# EAGLE design RadioGateway (EAGLE 7.6.0)
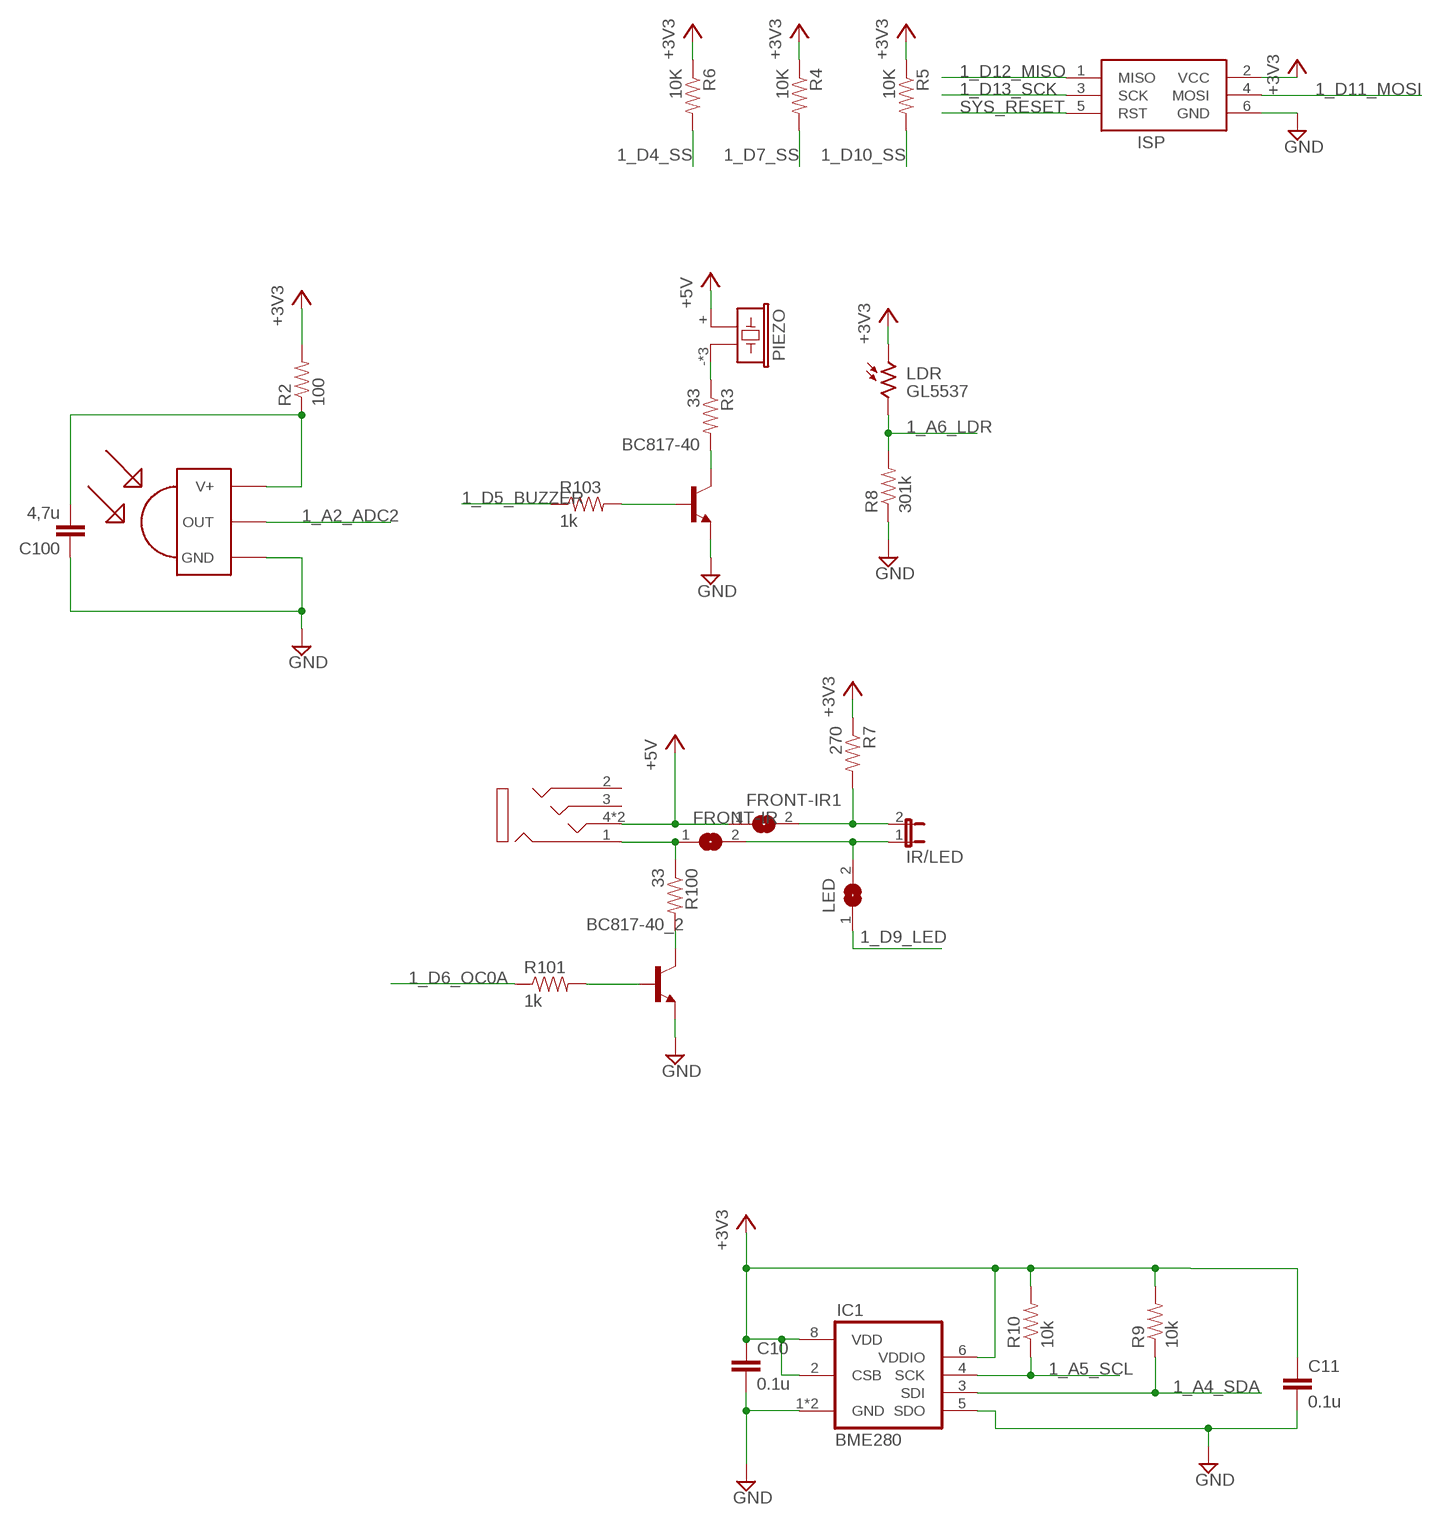
[diagram p0: schematic, sheet 1, part 1 of 2]
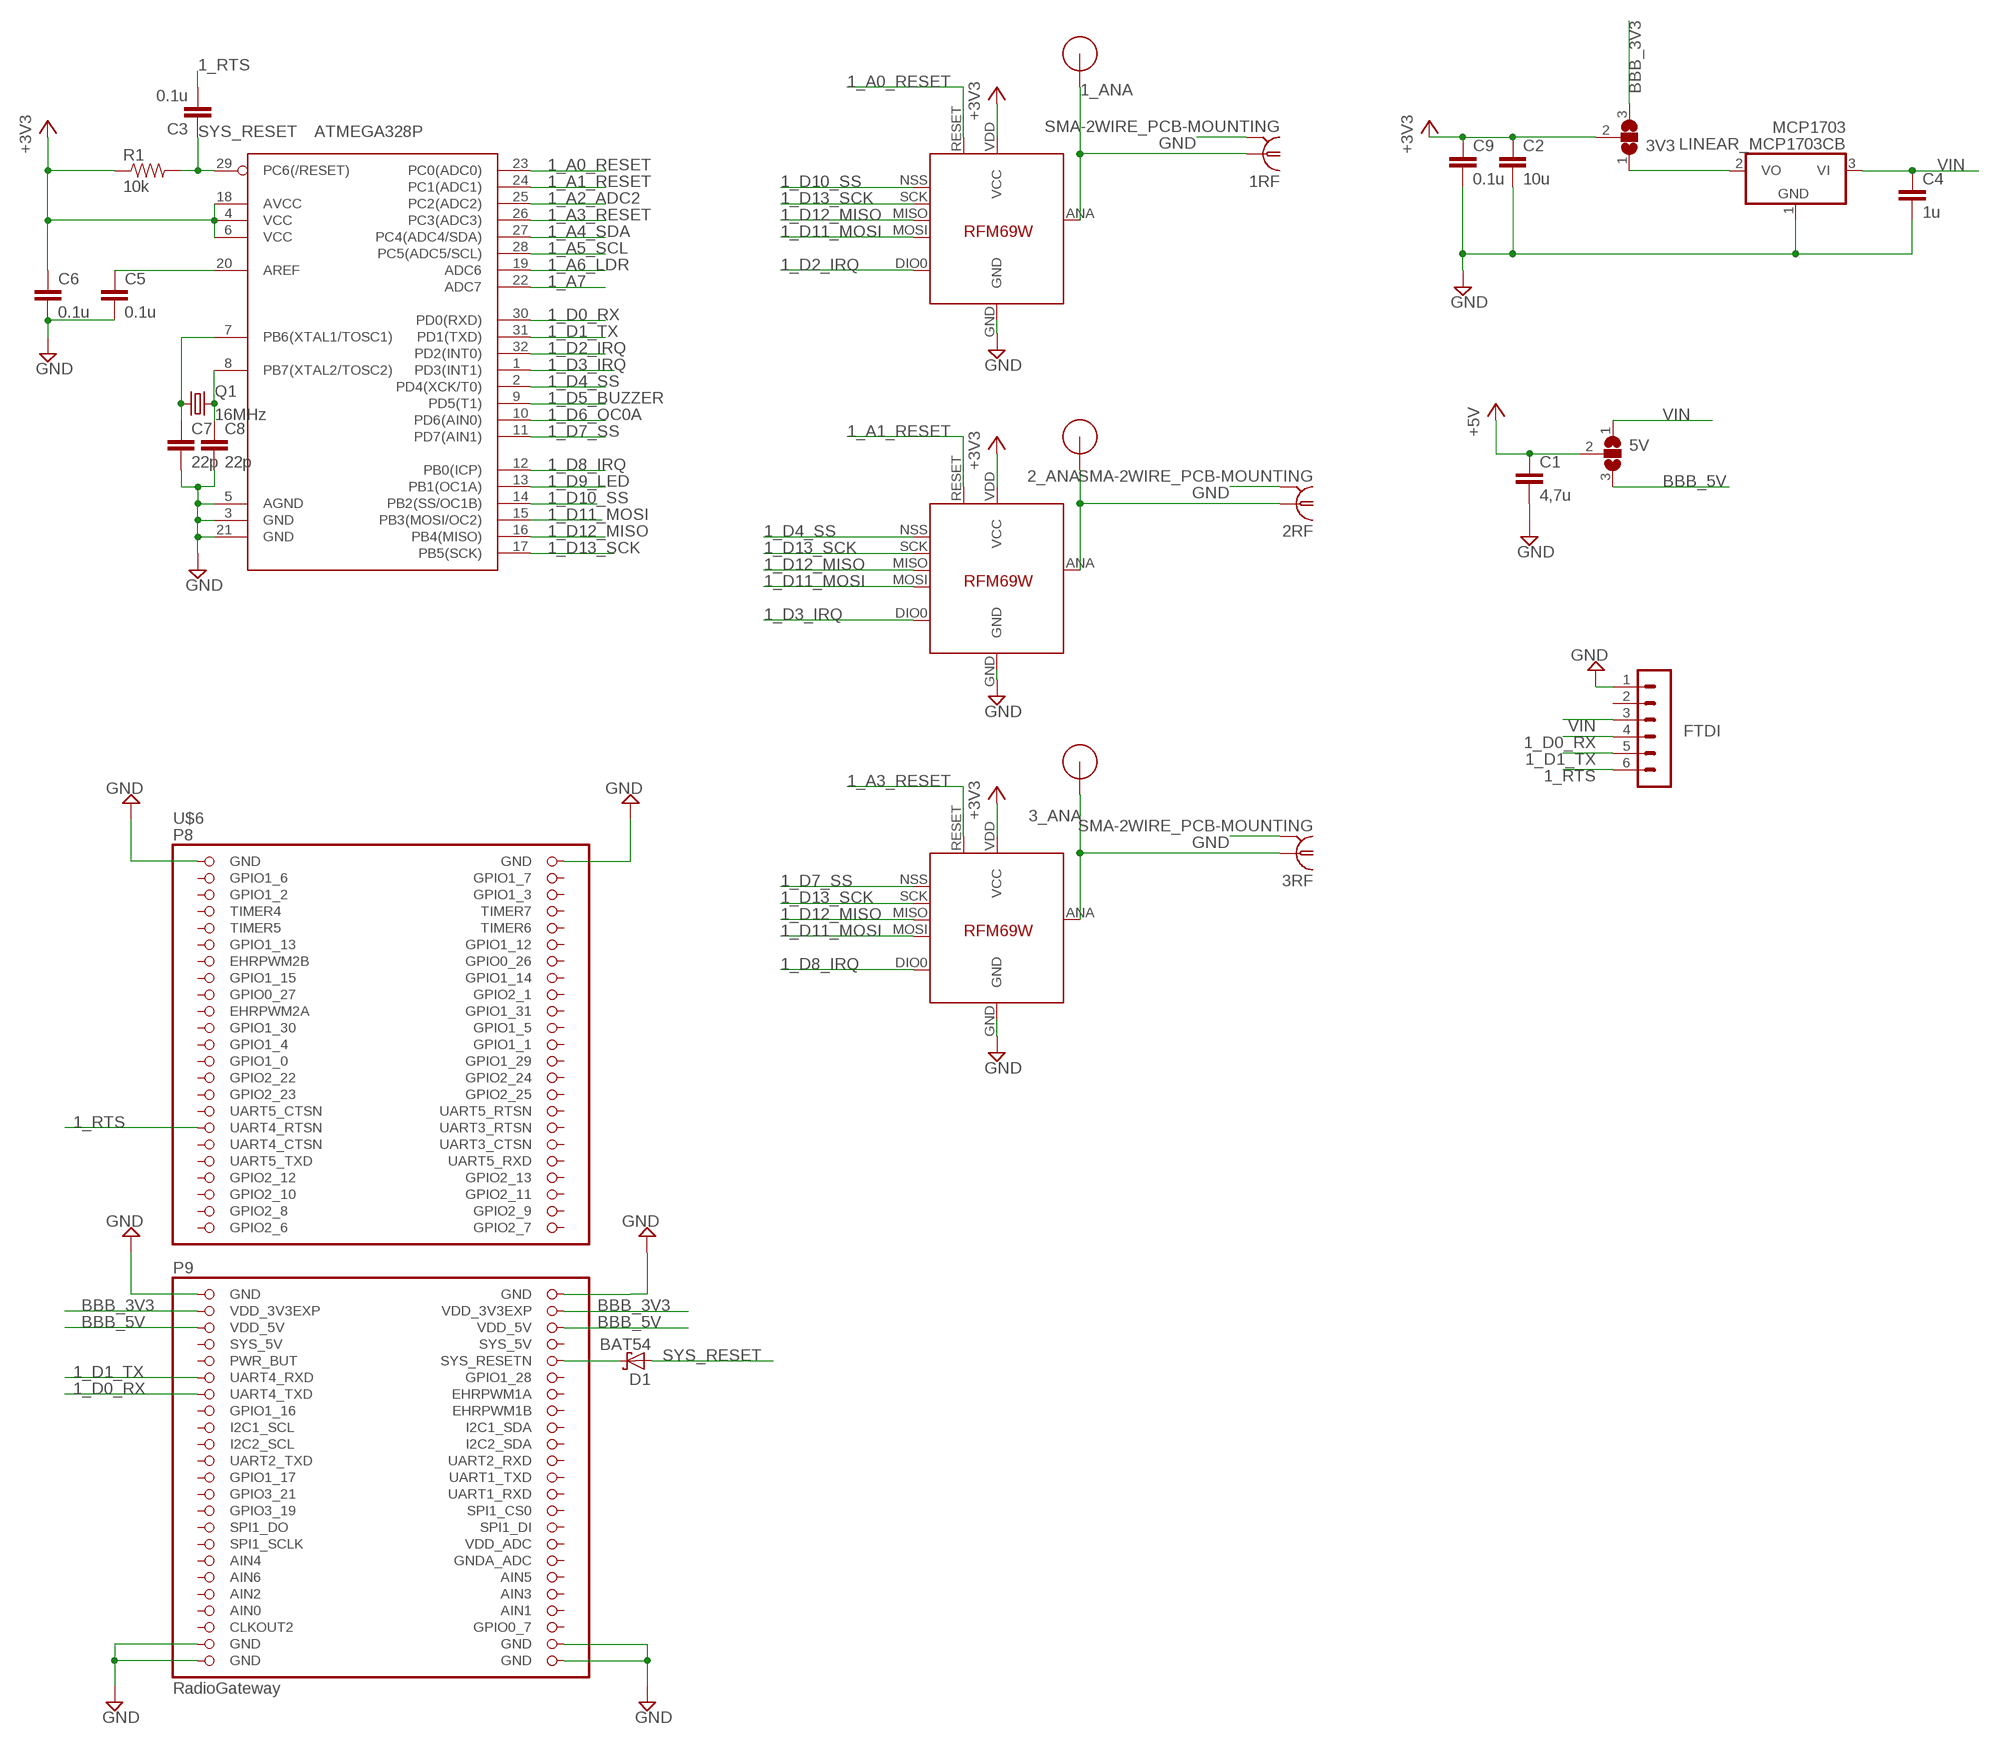
[diagram p1: schematic, sheet 1, part 2 of 2]

## Parts
1_RFM69  RFM69_MINIPADS  [RFM69W-MINPADS]
1RF  SMA-2WIRE_PCB-MOUNTING  [J01151A0931]
2_RFM69  RFM69_MINIPADS  [RFM69W-MINPADS]
2RF  SMA-2WIRE_PCB-MOUNTING  [J01151A0931]
3_RFM69  RFM69_MINIPADS  [RFM69W-MINPADS]
3RF  SMA-2WIRE_PCB-MOUNTING  [J01151A0931]
3V3  SJ2W  [SJ_2]
5V  SJ2W  [SJ_2]
ATMEGA328P  ATMega-328  ATMEGA168/328TQFP32  [TQFP32-08]
BC817-40  BC817-40-NPN-SOT23-BEC  [SOT23-BEC]
BC817-40_2  BC817-40-NPN-SOT23-BEC  [SOT23-BEC]
C1  4,7u  CAP0603-CAP  [0603-CAP]
C2  10u  CAP0603-CAP  [0603-CAP]
C3  0.1u  CAP0603-CAP  [0603-CAP]
C4  1u  CAP0603-CAP  [0603-CAP]
C5  0.1u  CAP0603-CAP  [0603-CAP]
C6  0.1u  CAP0603-CAP  [0603-CAP]
C7  22p  CAP0603-CAP  [0603-CAP]
C8  22p  CAP0603-CAP  [0603-CAP]
C9  0.1u  CAP0603-CAP  [0603-CAP]
C10  0.1u  CAP0603-CAP  [0603-CAP]
C11  0.1u  CAP0603-CAP  [0603-CAP]
C100  4,7u  CAP0603-CAP  [0603-CAP]
D1  BAT54  [SOT23]
FRONT-IR  SJ  [SJ]
FRONT-IR1  SJ  [SJ]
FTDI  FTDI  MA06-1  [MA06-1]
IC1  BME280  [BME280]
IR-RX  TSOP4836  [TSOP18XX]
IR-TX  1503_13  [1503-03]
IR/LED  JP1E  [JP1]
ISP  AVRISP-6  [AVRISP]
LDR  GL5537  M9960_11A  [M9960]
LED  SJ  [SJ]
MCP1703  LINEAR_MCP1703CB  [LINEAR_SOT23]
PIEZO  BUZZER-PIEZO_SMD  [BUZZER-PIEZO_SMD]
Q1  16MHz  CRYSTALHC49S  [HC49/S]
R1  10k  RESISTOR0603-RES  [0603-RES]
R2  100  RESISTOR0603-RES  [0603-RES]
R3  33  RESISTOR0603-RES  [0603-RES]
R4  10K  RESISTOR0603-RES  [0603-RES]
R5  10K  RESISTOR0603-RES  [0603-RES]
R6  10K  RESISTOR0603-RES  [0603-RES]
R7  270  RESISTOR0603-RES  [0603-RES]
R8  301k  RESISTOR0603-RES  [0603-RES]
R9  10k  RESISTOR0603-RES  [0603-RES]
R10  10k  RESISTOR0603-RES  [0603-RES]
R100  33  RESISTOR0603-RES  [0603-RES]
R101  1k  RESISTOR0603-RES  [0603-RES]
R103  1k  RESISTOR0603-RES  [0603-RES]
U$1  RFM12B_ANTENNA  [RFM12B-ANTENNA]
U$2  RFM12B_ANTENNA  [RFM12B-ANTENNA]
U$5  RFM12B_ANTENNA  [RFM12B-ANTENNA]
U$6  RadioGateway  BEAGLEBONE_OUTLINE  [BEAGLEBONE_SHIELD]

## Nets
1_A0_RESET: 1_RFM69.RESET ATMEGA328P.23(PC0(ADC0))
1_A1_RESET: 2_RFM69.RESET ATMEGA328P.24(PC1(ADC1))
1_A2_ADC2: ATMEGA328P.25(PC2(ADC2)) IR-RX.OUT
1_A3_RESET: 3_RFM69.RESET ATMEGA328P.26(PC3(ADC3))
1_A4_SDA: ATMEGA328P.27(PC4(ADC4/SDA)) IC1.3(SDI) R9.1
1_A5_SCL: ATMEGA328P.28(PC5(ADC5/SCL)) IC1.4(SCK) R10.1
1_A6_LDR: ATMEGA328P.19(ADC6) LDR.2 R8.2
1_A7: ATMEGA328P.22(ADC7)
1_ANA [ANT]: 1_RFM69.ANA(ANT) 1RF.1 U$1.P$1
1_AREF: ATMEGA328P.20(AREF) C5.1
1_D0_RX: ATMEGA328P.30(PD0(RXD)) FTDI.4 U$6.59(UART4_TXD)
1_D1_TX: ATMEGA328P.31(PD1(TXD)) FTDI.5 U$6.57(UART4_RXD)
1_D2_IRQ: 1_RFM69.DIO0(DIO0/IRQ) ATMEGA328P.32(PD2(INT0))
1_D3_IRQ: 2_RFM69.DIO0(DIO0/IRQ) ATMEGA328P.1(PD3(INT1))
1_D4_SS: 2_RFM69.NSS(SEL) ATMEGA328P.2(PD4(XCK/T0)) R6.2
1_D5_BUZZER: ATMEGA328P.9(PD5(T1)) R103.1
1_D6_OC0A: ATMEGA328P.10(PD6(AIN0)) R101.1
1_D7_SS: 3_RFM69.NSS(SEL) ATMEGA328P.11(PD7(AIN1)) R4.2
1_D8_IRQ: 3_RFM69.DIO0(DIO0/IRQ) ATMEGA328P.12(PB0(ICP))
1_D9_LED: ATMEGA328P.13(PB1(OC1A)) LED.1
1_D10_SS: 1_RFM69.NSS(SEL) ATMEGA328P.14(PB2(SS/OC1B)) R5.2
1_D11_MOSI: 1_RFM69.MOSI 2_RFM69.MOSI 3_RFM69.MOSI ATMEGA328P.15(PB3(MOSI/OC2)) ISP.4(MOSI)
1_D12_MISO: 1_RFM69.MISO 2_RFM69.MISO 3_RFM69.MISO ATMEGA328P.16(PB4(MISO)) ISP.1(MISO)
1_D13_SCK: 1_RFM69.SCK 2_RFM69.SCK 3_RFM69.SCK ATMEGA328P.17(PB5(SCK)) ISP.3(SCK)
1_RTS: C3.2 FTDI.6 U$6.33(UART4_RTSN)
2_ANA [ANT]: 2_RFM69.ANA(ANT) 2RF.1 U$5.P$1
3_ANA [ANT]: 3_RFM69.ANA(ANT) 3RF.1 U$2.P$1
+3V3 [power]: 1_RFM69.VDD(VCC) 2_RFM69.VDD(VCC) 3_RFM69.VDD(VCC) 3V3.2 ATMEGA328P.4(VCC) ATMEGA328P.6(VCC) ATMEGA328P.18(AVCC) C2.1 C6.1 C9.1 C10.1 C11.1 IC1.2(CSB) IC1.6(VDDIO) IC1.8(VDD) ISP.2(VCC) LDR.1 R1.1 R2.2 R4.1 R5.1 R6.1 R7.1 R9.2 R10.2
+5V [power]: 5V.2 C1.1 FRONT-IR1.1 IR-TX.4 IR-TX.4-2 PIEZO.+
BBB_3V3 [power]: 3V3.3 U$6.49(VDD_3V3EXP) U$6.50(VDD_3V3EXP)
BBB_5V [power]: 5V.3 U$6.51(VDD_5V) U$6.52(VDD_5V)
GND [power]: 1_RFM69.GND 1RF.G@1 1RF.G@2 1RF.G@3 1RF.G@4 2_RFM69.GND 2RF.G@1 2RF.G@2 2RF.G@3 2RF.G@4 3_RFM69.GND 3RF.G@1 3RF.G@2 3RF.G@3 3RF.G@4 ATMEGA328P.3(GND) ATMEGA328P.5(AGND) ATMEGA328P.21(GND) BC817-40.E BC817-40_2.E C1.2 C2.2 C4.2 C5.2 C6.2 C7.2 C8.2 C9.2 C10.2 C11.2 C100.1 FTDI.1 IC1.1(GND) IC1.5(SDO) IC1.7(GND) IR-RX.GND ISP.6(GND) MCP1703.1(GND) R8.1 U$6.1(GND) U$6.2(GND) U$6.47(GND) U$6.48(GND) U$6.89(GND) U$6.90(GND) U$6.91(GND) U$6.92(GND)
N$1: ATMEGA328P.7(PB6(XTAL1/TOSC1)) C7.1 Q1.1
N$2: PIEZO.- PIEZO.DUMMY PIEZO.DUMMY1 R3.1
N$3: FRONT-IR.1 IR-TX.1 R100.1
N$4: BC817-40_2.C R100.2
N$5: D1.3(C) U$6.56(SYS_RESETN)
N$6: 3V3.1 MCP1703.2(VO)
N$7: ATMEGA328P.8(PB7(XTAL2/TOSC2)) C8.1 Q1.2
N$8: BC817-40.C R3.2
N$9: FRONT-IR.2 IR/LED.1 LED.2
N$10: FRONT-IR1.2 IR/LED.2 R7.2
N$15: BC817-40.B R103.2
N$16: C100.2 IR-RX.VCC(V+) R2.1
N$19: BC817-40_2.B R101.2
SYS_RESET: ATMEGA328P.29(PC6(/RESET)) C3.1 D1.1(A) ISP.5(RST) R1.2
VIN [power]: 5V.1 C4.1 FTDI.3 MCP1703.3(VI)
Unconnected: FTDI.2 IR-TX.2 IR-TX.3 U$6.3(GPIO1_6) U$6.4(GPIO1_7) U$6.5(GPIO1_2) U$6.6(GPIO1_3) U$6.7(TIMER4) U$6.8(TIMER7) U$6.9(TIMER5) U$6.10(TIMER6) U$6.11(GPIO1_13) U$6.12(GPIO1_12) U$6.13(EHRPWM2B) U$6.14(GPIO0_26) U$6.15(GPIO1_15) U$6.16(GPIO1_14) U$6.17(GPIO0_27) U$6.18(GPIO2_1) U$6.19(EHRPWM2A) U$6.20(GPIO1_31) U$6.21(GPIO1_30) U$6.22(GPIO1_5) U$6.23(GPIO1_4) U$6.24(GPIO1_1) U$6.25(GPIO1_0) U$6.26(GPIO1_29) U$6.27(GPIO2_22) U$6.28(GPIO2_24) U$6.29(GPIO2_23) U$6.30(GPIO2_25) U$6.31(UART5_CTSN) U$6.32(UART5_RTSN) U$6.34(UART3_RTSN) U$6.35(UART4_CTSN) U$6.36(UART3_CTSN) U$6.37(UART5_TXD) U$6.38(UART5_RXD) U$6.39(GPIO2_12) U$6.40(GPIO2_13) U$6.41(GPIO2_10) U$6.42(GPIO2_11) U$6.43(GPIO2_8) U$6.44(GPIO2_9) U$6.45(GPIO2_6) U$6.46(GPIO2_7) U$6.54(SYS_5V) U$6.55(PWR_BUT) U$6.58(GPIO1_28) U$6.60(EHRPWM1A) U$6.61(GPIO1_16) U$6.62(EHRPWM1B) U$6.63(I2C1_SCL) U$6.64(I2C1_SDA) U$6.65(I2C2_SCL) U$6.66(I2C2_SDA) U$6.67(UART2_TXD) U$6.68(UART2_RXD) U$6.69(GPIO1_17) U$6.70(UART1_TXD) U$6.71(GPIO3_21) U$6.72(UART1_RXD) U$6.73(GPIO3_19) U$6.74(SPI1_CS0) U$6.75(SPI1_DO) U$6.76(SPI1_DI) U$6.77(SPI1_SCLK) U$6.78(VDD_ADC) U$6.79(AIN4) U$6.80(GNDA_ADC) U$6.81(AIN6) U$6.82(AIN5) U$6.83(AIN2) U$6.84(AIN3) U$6.86(AIN1) U$6.87(CLKOUT2) U$6.88(GPIO0_7)

## Power pins joined to a net without a drawn wire
AIN0: U$6.85(AIN0)
SYS_5V: U$6.53(SYS_5V)

## Library data of the parts
1_RFM69 2_RFM69 3_RFM69 = myLib:RFM69_MINIPADS
1RF 2RF 3RF = myLib:SMA-2WIRE_PCB-MOUNTING: SMA 50 Ohm Straight Jack Receptacle - PCB Mountung www.telegaertner.de Source: Buerklin Artikelnummer: J01151A0931; BUERKLIN: 76F410; EBAY: SMA Female PCB Edge
3V3 5V = jumper:SJ2W: SMD solder JUMPER
ATMEGA328P = myLib:ATMEGA168/328: Atmel 32-pin 8-bit micro, 16k flash.; BUERKLIN: 64 S 3046; CONRAD: 155196 - 62
BC817-40 BC817-40_2 = myLib:*-NPN-: NPN Transistror BF959 corrected 2008.03.06; BUERKLIN: 12S6220
C1 C100 = LowPowerLab:CAP: Capacitor Standard 0603 ceramic capacitor, and 0.1" leaded capacitor.; BUERKLIN: 53 D 1659
C2 = LowPowerLab:CAP: Capacitor Standard 0603 ceramic capacitor, and 0.1" leaded capacitor.; BUERKLIN: 53 D 1652
C3 C5 C6 C9-C11 = LowPowerLab:CAP: Capacitor Standard 0603 ceramic capacitor, and 0.1" leaded capacitor.; BUERKLIN: 53 D 1726
C4 = LowPowerLab:CAP: Capacitor Standard 0603 ceramic capacitor, and 0.1" leaded capacitor.; BUERKLIN: 53D1660
C7 C8 = LowPowerLab:CAP: Capacitor Standard 0603 ceramic capacitor, and 0.1" leaded capacitor.; BUERKLIN: 53 D 1676
D1 = diode:BAT54: Schottky Diodes Source: Fairchild .. BAT54.pdf; BUERKLIN: 10S7581
FRONT-IR FRONT-IR1 LED = jumper:SJ: SMD solder JUMPER
FTDI = JeeLabs:MA06-1: PIN HEADER; BUERKLIN: 59 F 2134
IC1 = myLib:BME280: DIGITAL HUMIDITY, PRESSURE AND TEMPERATURE SENSOR * Digital interface I²C (up to 3.4 MHz) and SPI (3 and 4 wire, up to 10 MHz)* Supply voltage VDD main supply voltage range: 1.71 V to 3.6 V*VDDIO interface voltage range: 1.2 V to 3.6 V Operating range -40…+85 °C, 0…100 % rel. humidity, 300…1100 hPa The library has been designed by Richard Magdycz <https://www.facebook.com/groups/eaglecadsoftUK>; BUERKLIN: 65 S 100
IR-RX = myLib:TSOP4836: IR Receiver and Demodulator; CONRAD: 171107-62; EBAY: TSOP34836
IR-TX = myLib:1503_13; BUERKLIN: 39F1215
IR/LED = jumper:JP1E: JUMPER; BUERKLIN: 65S2292
ISP = myLib:AVRISP: AVR ISP HEADER Standard 6 pin header for AVR programming; BUERKLIN: 56F6228; CONRAD: 737480 - 62
LDR = photo-elements:M9960_11: Photo Sensor Beacon Light, Photometer Applications Source: http://optoelectronics.perkinelmer.com/content/Datasheets/DTS_M9960.pdf; EBAY: GL5537
MCP1703 = myLib:LINEAR_MCP1703: 250 mA, 16V, Low Quiescent Current LDO Regulator Source: http://ww1.microchip.com/downloads/en/DeviceDoc/22049b.pdf; BUERKLIN: 41 S 7654; CONRAD: 651422-62
PIEZO = myLib:BUZZER-PIEZO_SMD: Piezoelectric Acoustic Transducer; BUERKLIN: 36 M 370
Q1 = crystal:CRYSTAL: CRYSTAL; BUERKLIN: 78D428; OC_FARNELL: 1667008; OC_NEWARK: unknown
R1 R4-R6 R9 R10 = LowPowerLab:RESISTOR: Resistor Basic schematic elements and footprints for 0603, 1206, and PTH resistors.; BUERKLIN: 26 E 816
R2 = LowPowerLab:RESISTOR: Resistor Basic schematic elements and footprints for 0603, 1206, and PTH resistors.; BUERKLIN: 26 E 768
R3 R100 = LowPowerLab:RESISTOR: Resistor Basic schematic elements and footprints for 0603, 1206, and PTH resistors.; BUERKLIN: 26 E 756
R7 = LowPowerLab:RESISTOR: Resistor Basic schematic elements and footprints for 0603, 1206, and PTH resistors.; BUERKLIN: 26 E 778
R8 = LowPowerLab:RESISTOR: Resistor Basic schematic elements and footprints for 0603, 1206, and PTH resistors.; BUERKLIN: 26 E 7197
R101 R103 = LowPowerLab:RESISTOR: Resistor Basic schematic elements and footprints for 0603, 1206, and PTH resistors.; BUERKLIN: 26 E 792
U$1 U$2 U$5 = LowPowerLab:RFM12B_ANTENNA
U$6 = myLib:BEAGLEBONE_OUTLINE: Should match A3 pinout - but not completely tested; CONRAD: 393509 - 62

## Net classes
0 default: width 0.254 mm
1 power: width 0.381 mm, clearance 0.381 mm
2 ANT: width 1.27 mm, clearance 0.254 mm

## Board
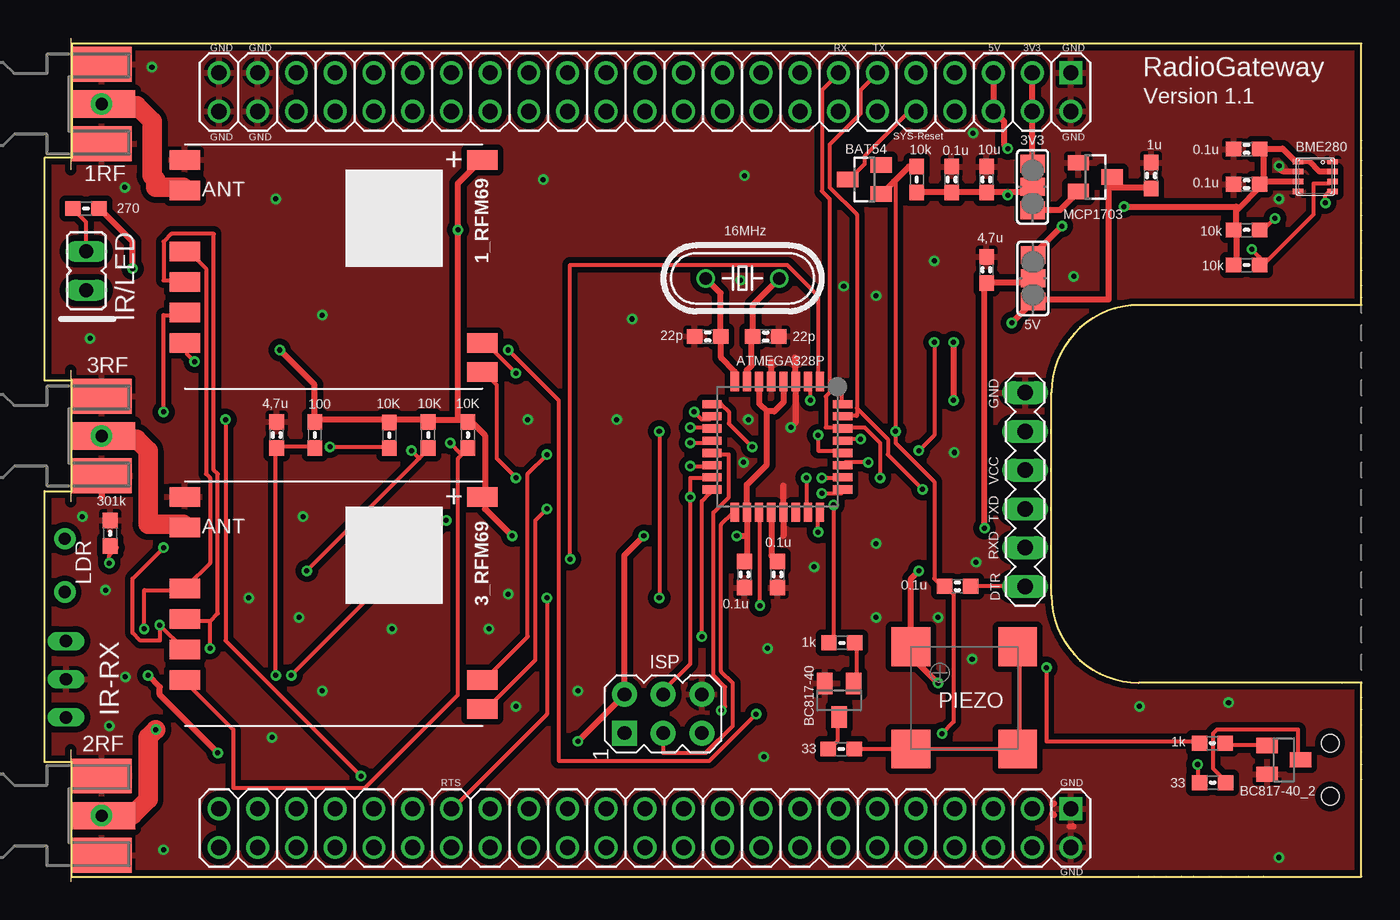
[diagram p2: board, top side]
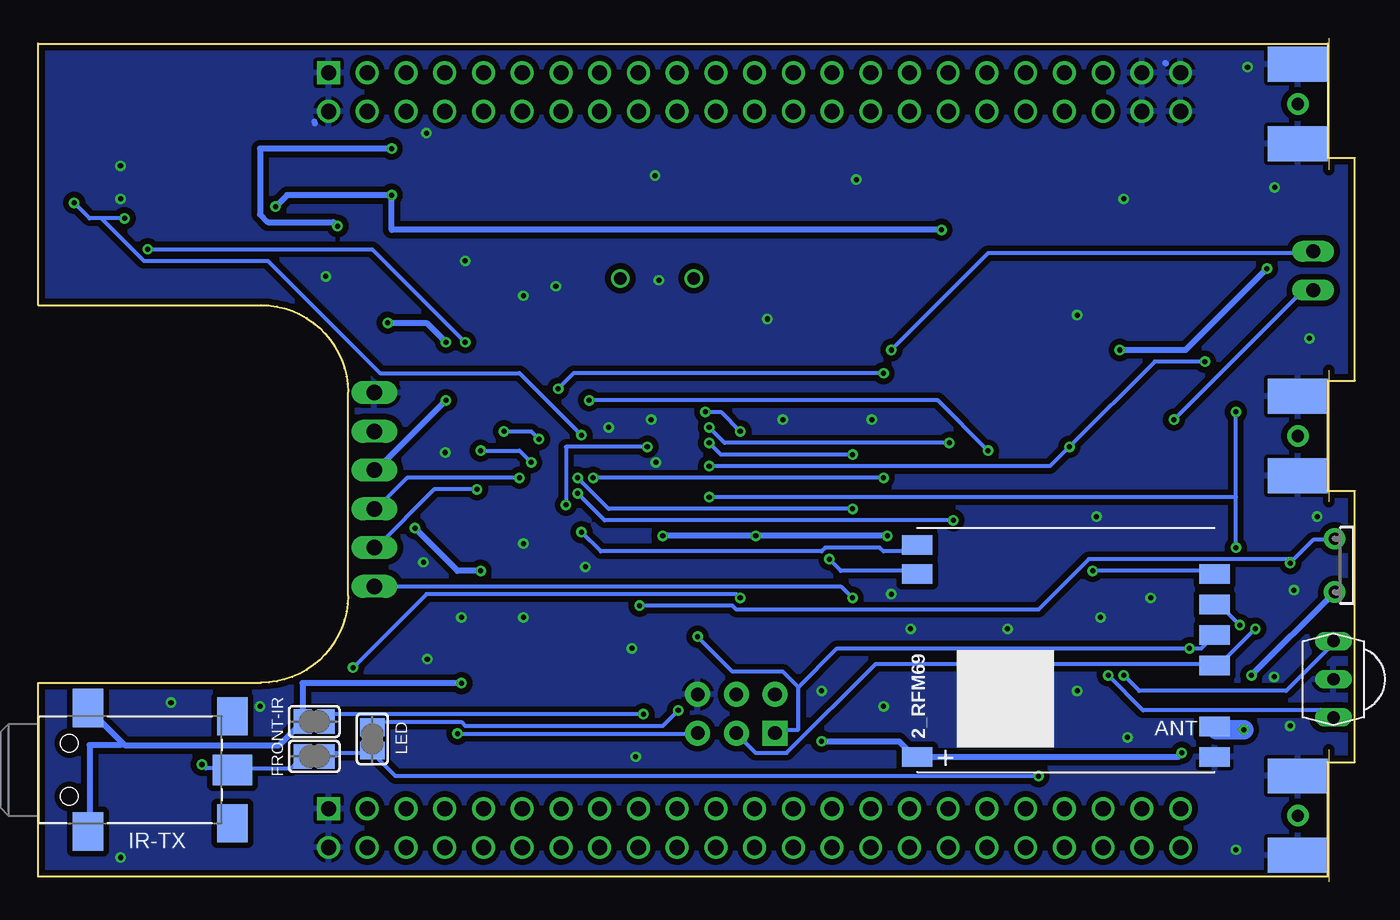
[diagram p3: board, bottom side, seen from below]

Size 86.36 x 55.3 mm. Coordinates in mm from the lower left corner, seen from the top.
Copper layers (1*16): Top 0.0356mm / dielectric 1.5011mm / Bottom 0.0356mm
Design rules "LaenPCBOrder": minimum track width 6mil, minimum drill 13mil, track to track 6mil, track to pad 6mil, pad to pad 6mil, via to via 6mil, smd to smd 6mil, copper to edge 15mil, drill to drill 6mil, minimum pad ring 7mil, minimum via ring 7mil, stop-mask expansion 3mil, vias tented up to drill 0mil, thermal gap 10mil

### Footprints (pad centres in the part's own frame; a part is rotated, then mirrored left to right if it is on the bottom)
RFM69W-MINPADS = smd 2 x 1.27: ANA 8,-5; DIO0 -11.5,5; GND 8,-7; MISO 8,1; MOSI 8,3; NSS 8,5; RESET -11.5,6.909; SCK 8,-1; VDD -11.5,-7
J01151A0931 = smd 4.191 x 1.778: 1 2.134,0 | smd 3.937 x 2.286: G@1 2.032,2.6; G@2 2.032,-2.6 | smd 3.937 x 2.286 bottom: G@3 2.032,2.6; G@4 2.032,-2.6
SJ_2 = smd 1.168 x 1.6: 1 -1.524,0; 2 0,0; 3 1.524,0
TQFP32-08 = smd 1.27 x 0.533: 1 -4.293,2.8; 2 -4.293,2; 3 -4.293,1.2; 4 -4.293,0.4; 5 -4.293,-0.4; 6 -4.293,-1.2; 7 -4.293,-2; 8 -4.293,-2.8; 17 4.293,-2.8; 18 4.293,-2; 19 4.293,-1.2; 20 4.293,-0.4; 21 4.293,0.4; 22 4.293,1.2; 23 4.293,2; 24 4.293,2.8 | smd 0.533 x 1.27: 9 -2.8,-4.293; 10 -2,-4.293; 11 -1.2,-4.293; 12 -0.4,-4.293; 13 0.4,-4.293; 14 1.2,-4.293; 15 2,-4.293; 16 2.8,-4.293; 25 2.8,4.293; 26 2,4.293; 27 1.2,4.293; 28 0.4,4.293; 29 -0.4,4.293; 30 -1.2,4.293; 31 -2,4.293; 32 -2.8,4.293
SOT23-BEC = smd 1 x 1.4: B -0.95,-1.1; C 0,1.1; E 0.95,-1.1
0603-CAP = smd 1.016 x 0.965: 1 -0.85,0; 2 0.85,0
SOT23 = smd 1 x 1.4: 1 -0.95,-1.1; 2 0.95,-1.1; 3 0,1.1
SJ = smd 1.168 x 1.6: 1 -0.762,0; 2 0.762,0
MA06-1 = drill 1.016 long: 1 0,0; 2 2.54,0; 3 5.08,0; 4 7.62,0; 5 10.16,0; 6 12.7,0
BME280 = smd 0.35 x 0.7: 1 0.975,-1.125; 2 0.325,-1.125; 3 -0.325,-1.125; 4 -0.975,-1.125; 5 -0.975,1.125; 6 -0.325,1.125; 7 0.325,1.125; 8 0.975,1.125
TSOP18XX = drill 0.813 long: GND -0.001,-0.027; OUT -2.501,-0.027; VCC 2.499,-0.027
1503-03 = smd 2.6 x 2: 1 12.7,0 | smd 2 x 2.5: 2 12.7,-3.5; 3 12.7,3.5; 4 3.2,4.05; 4-2 3.2,-4.05 | hole 1.15: 2,-1.75; 2,1.75
JP1 = drill 0.914 long: 1 0,-1.27; 2 0,1.27
AVRISP = drill 0.9 pad 1.626 square: 1 -1.27,2.54 | drill 0.9 pad 1.626: 2 1.27,2.54; 3 -1.27,0; 4 1.27,0; 5 -1.27,-2.54; 6 1.27,-2.54
M9960 = drill 0.8 pad 1.4: 1 -1.75,0; 2 1.75,0
LINEAR_SOT23 = smd 1 x 1.4: 1 -0.95,-1.1; 2 0.95,-1.1; 3 0,1.1
BUZZER-PIEZO_SMD = smd 2.54 x 2.54: + 0,6.7; - 7,6.7; DUMMY 0,0; DUMMY1 7,0
HC49/S = drill 0.813: 1 -2.413,0; 2 2.413,0
0603-RES = smd 1.016 x 0.965: 1 -0.85,0; 2 0.85,0
RFM12B-ANTENNA = drill 0.8 pad 1.422: P$1 0,0
BEAGLEBONE_SHIELD = drill 1 square: 1 4.445,19.05; 47 52.705,19.05 | drill 1: 2 1.905,19.05; 3 4.445,21.59; 4 1.905,21.59; 5 4.445,24.13; 6 1.905,24.13; 7 4.445,26.67; 8 1.905,26.67; 9 4.445,29.21; 10 1.905,29.21; 11 4.445,31.75; 12 1.905,31.75; 13 4.445,34.29; 14 1.905,34.29; 15 4.445,36.83; 16 1.905,36.83; 17 4.445,39.37; 18 1.905,39.37; 19 4.445,41.91; 20 1.905,41.91; 21 4.445,44.45; 22 1.905,44.45; 23 4.445,46.99; 24 1.905,46.99; 25 4.445,49.53; 26 1.905,49.53; 27 4.445,52.07; 28 1.905,52.07; 29 4.445,54.61; 30 1.905,54.61; 31 4.445,57.15; 32 1.905,57.15; 33 4.445,59.69; 34 1.905,59.69; 35 4.445,62.23; 36 1.905,62.23; 37 4.445,64.77; 38 1.905,64.77; 39 4.445,67.31; 40 1.905,67.31; 41 4.445,69.85; 42 1.905,69.85; 43 4.445,72.39; 44 1.905,72.39; 45 4.445,74.93; 46 1.905,74.93; 48 50.165,19.05; 49 52.705,21.59; 50 50.165,21.59; 51 52.705,24.13; 52 50.165,24.13; 53 52.705,26.67; 54 50.165,26.67; 55 52.705,29.21; 56 50.165,29.21; 57 52.705,31.75; 58 50.165,31.75; 59 52.705,34.29; 60 50.165,34.29; 61 52.705,36.83; 62 50.165,36.83; 63 52.705,39.37; 64 50.165,39.37; 65 52.705,41.91; 66 50.165,41.91; 67 52.705,44.45; 68 50.165,44.45; 69 52.705,46.99; 70 50.165,46.99; 71 52.705,49.53; 72 50.165,49.53; 73 52.705,52.07; 74 50.165,52.07; 75 52.705,54.61; 76 50.165,54.61; 77 52.705,57.15; 78 50.165,57.15; 79 52.705,59.69; 80 50.165,59.69; 81 52.705,62.23; 82 50.165,62.23; 83 52.705,64.77; 84 50.165,64.77; 85 52.705,67.31; 86 50.165,67.31; 87 52.705,69.85; 88 50.165,69.85; 89 52.705,72.39; 90 50.165,72.39; 91 52.705,74.93; 92 50.165,74.93

### Placement (x,y rotation side)
1_RFM69  17.2,40.31 180 top
1RF  1.7,50.98 0 top
2_RFM69  17.2,15.16 0 bottom
2RF  1.7,4.32 0 top
3_RFM69  17.2,18.21 180 top
3RF  1.7,29.21 0 top
3V3  64.8,45.54 90 top
5V  64.82,39.55 90 top
ATMEGA328P  48.06,28.5 270 top
BC817-40  52.11,11.88 180 top
BC817-40_2  81.28,7.98 270 top
C1  61.77,40.11 90 top
C2  61.77,46.02 90 top
C3  59.87,19.35 0 top
C4  72.57,46.28 90 top
C5  48.06,20.12 270 top
C6  45.9,20.12 270 top
C7  47.3,35.74 0 top
C8  43.48,35.74 180 top
C9  59.49,46.02 90 top
C10  78.83,48.02 180 top
C11  78.83,45.72 180 top
C100  15.21,29.29 270 top
D1  53.77,46.02 90 top
FRONT-IR  68.25,8.2 0 bottom
FRONT-IR1  68.25,10.49 0 bottom
FTDI  64.31,32.05 270 top
IC1  83.33,46.22 90 top
IR-RX  1.42,13.26 90 bottom
IR-TX  86.31,7.33 0 bottom
IR/LED  2.73,40.04 0 top
ISP  40.56,11 90 top
LDR  1.32,20.73 90 bottom
LED  64.44,9.35 270 bottom
MCP1703  68.9,46.18 270 top
PIEZO  56.82,8.69 0 top
Q1  45.77,39.55 180 top
R1  57.2,46.02 90 top
R2  17.73,29.29 90 top
R3  52.25,8.69 180 top
R4  27.76,29.29 270 top
R5  22.6,29.26 270 top
R6  25.15,29.29 270 top
R7  2.72,44.12 180 top
R8  4.29,22.83 270 top
R9  78.83,40.42 180 top
R10  78.83,42.72 180 top
R100  76.61,6.48 0 top
R101  76.58,9.07 0 top
R103  52.29,15.65 0 top
U$1  3.73,50.98 0 top
U$2  3.73,29.21 0 top
U$5  3.73,4.32 0 top
U$6  86.36,0.33 90 top

### Tracks (layer width: path | path; a pad name or v marks a point on that pad's centre or on a via)
1_A0_RESET  (via drill 0.33)
  Top 0.254: v49.96,26.47 49.96,24.43 ATMEGA328P.23 | v30.91,26.47 29.64,27.74 29.64,32.56 28.88,33.32 1_RFM69.RESET
  Bottom 0.254: v30.91,26.47 v49.96,26.47
1_A1_RESET  (via drill 0.33)
  Top 0.254: v50.72,22.91 50.72,24.18 ATMEGA328P.24
  Bottom 0.254: v50.72,22.91 49.45,21.64 34.98,21.64 34.72,21.89 31.17,21.89 30.91,21.64 29.13,21.64 28.88,21.89 2_RFM69.RESET
1_A2_ADC2  (via drill 0.33)
  Top 0.254: v50.98,25.45 52.25,25.45 ATMEGA328P.25 | v16.18,13.51 v26.34,23.67
  Bottom 0.254: v50.98,25.45 49.2,23.67 v26.34,23.67 | v16.18,13.51 13.89,11.23 1.7,11.23 1.45,10.97 IR-RX.OUT
1_A3_RESET  (via drill 0.33)
  Top 0.254: v50.98,26.47 52.25,26.47 ATMEGA328P.26 | v32.94,24.43 32.18,23.67 32.18,14.53 28.88,11.23 3_RFM69.RESET
  Bottom 0.254: v50.98,26.47 48.95,24.43 v32.94,24.43
1_A4_SDA  (via drill 0.33)
  Top 0.254: IC1.3 84.25,45.77 83.24,45.77 83.24,43.74 79.93,40.44 R9.1 79.68,40.44 79.68,40.94 v79.17,41.45 | v54.03,27.48 52.5,27.48 ATMEGA328P.27 | v57.33,28.24 58.34,29.26 v58.34,35.36
  Bottom 0.254: v54.03,27.48 54.79,28.24 v57.33,28.24 | v58.34,35.36 64.44,41.45 v79.17,41.45
1_A5_SCL  (via drill 0.33)
  Top 0.254: v84,44.5 84,45.01 84.25,45.26 IC1.4 | v80.7,43.48 79.93,42.72 R10.1 | v50.72,29.26 50.72,28.24 52.25,28.24 ATMEGA328P.28
  Bottom 0.254: v84,44.5 82.98,43.48 82.22,43.48 | v80.7,43.48 82.22,43.48 | v50.72,29.26 54.79,33.32 63.93,33.32 71.3,40.69 79.43,40.69 82.22,43.48
1_A6_LDR  (via drill 0.33)
  Top 0.254: v4.24,20.88 4.24,21.39 4.75,21.89 R8.2 | v46.91,18.08 46.91,24.18 ATMEGA328P.19
  Bottom 0.254: 3.99,21.13 2.72,22.4 1.45,22.4 LDR.2 | 3.99,21.13 v4.24,20.88 | v46.91,18.08 40.82,18.08 40.56,17.83 20.75,17.83 17.45,21.13 3.99,21.13
1_ANA
  Top 1.27: 1_RFM69.ANA 9.07,45.52 7.29,45.52 7.29,46.02 7.04,46.28 7.04,49.83 6.02,50.85 3.99,50.85 1RF.1 3.73,51.1 U$1.P$1
1_AREF
  Top 0.381: ATMEGA328P.20 47.66,21.37 C5.1
1_D0_RX  (via drill 0.33)
  Top 0.254: U$6.59 51.99,52.88 50.98,51.87 50.98,45.26 51.49,44.75 51.49,32.05 51.23,31.8 51.23,29.77 52.25,29.77 ATMEGA328P.30 52.5,29.77 53.77,29.77 54.79,28.75 v54.79,26.47
  Bottom 0.254: v54.79,26.47 62.15,26.47 64.19,24.43 FTDI.4
1_D1_TX  (via drill 0.33)
  Top 0.254: 53.26,31.04 53.26,43.74 51.49,45.52 51.49,48.31 53.52,50.34 53.52,51.87 54.53,52.88 U$6.57 | 53.26,31.04 53.26,30.53 52.5,30.53 ATMEGA328P.31 | v57.58,25.7 55.3,27.99 55.3,29.01 53.26,31.04
  Bottom 0.254: v57.58,25.7 60.38,25.7 64.19,21.89 FTDI.5
1_D2_IRQ  (via drill 0.33)
  Top 0.254: v52.25,32.31 52.25,31.55 ATMEGA328P.32 | v30.91,33.32 28.88,35.36 1_RFM69.DIO0
  Bottom 0.254: v52.25,32.31 51.23,33.32 v30.91,33.32
1_D3_IRQ  (via drill 0.33)
  Top 0.254: v34.47,21.13 34.47,40.44 48.69,40.44 50.72,38.4 50.72,32.82 ATMEGA328P.1
  Bottom 0.254: v34.47,21.13 33.71,20.37 28.88,20.37 2_RFM69.DIO0
1_D4_SS  (via drill 0.33)
  Top 0.254: v17.2,20.37 24.56,27.74 | 24.56,27.74 25.07,28.24 R6.2 | v50.22,31.55 50.22,32.56 ATMEGA328P.2 | 24.56,27.74 v24.05,28.24
  Bottom 0.254: v17.2,20.37 9.32,20.37 2_RFM69.NSS | v50.22,31.55 27.36,31.55 v24.05,28.24
1_D5_BUZZER  (via drill 0.33)
  Top 0.254: v51.74,24.69 51.74,16.05 51.49,15.8 R103.1 | v46.41,28.5 44.88,30.02 44.88,30.78 44.37,31.29 43.87,31.29 ATMEGA328P.9
  Bottom 0.254: v51.74,24.69 51.74,28.5 v46.41,28.5
1_D6_OC0A  (via drill 0.33)
  Top 0.254: v65.71,14.02 65.71,9.19 75.62,9.19 R101.1 | v40.31,29.51 v40.31,18.59 | v42.6,30.78 43.1,30.28 43.61,30.28 ATMEGA328P.10
  Bottom 0.254: v65.71,14.02 60.88,18.85 40.56,18.85 v40.31,18.59 | v40.31,29.51 41.58,30.78 v42.6,30.78
1_D7_SS  (via drill 0.33)
  Top 0.254: 27.36,27.99 27.1,27.74 27.1,12.24 21.01,6.15 12.37,6.15 12.37,9.96 9.32,13 3_RFM69.NSS | 27.36,27.99 27.61,28.24 R4.2 27.36,27.99 | v42.34,29.77 43.61,29.77 ATMEGA328P.11 | 27.36,27.99 v26.59,28.75
  Bottom 0.254: v42.34,29.77 41.33,28.75 v26.59,28.75
1_D8_IRQ  (via drill 0.33)
  Top 0.254: v42.34,28.75 43.61,28.75 ATMEGA328P.12 | v32.94,27.99 31.67,26.72 31.67,16.05 28.88,13.26 3_RFM69.DIO0
  Bottom 0.254: v42.34,28.75 41.58,27.99 v32.94,27.99
1_D9_LED  (via drill 0.33)
  Top 0.254: v44.37,11.23 44.63,11.48 44.63,12.75 43.87,13.51 43.87,24.18 44.88,25.2 44.88,27.99 43.87,27.99 ATMEGA328P.13
  Bottom 0.254: v44.37,11.23 45.39,10.21 58.34,10.21 58.6,10.46 64.19,10.46 64.44,10.21 LED.1
1_D10_SS  (via drill 0.33)
  Top 0.254: v18.72,28.5 22.53,28.5 R5.2 | v9.83,34.09 9.32,34.59 9.32,35.1 1_RFM69.NSS | v42.34,27.23 43.61,27.23 ATMEGA328P.14
  Bottom 0.254: v9.83,34.09 13.13,34.09 v18.72,28.5 19.99,27.23 v42.34,27.23
1_D11_MOSI  (via drill 0.33)
  Top 0.254: ATMEGA328P.15 43.61,26.47 42.34,26.47 v42.34,25.2 42.34,14.27 40.56,12.5 ISP.4 | 3_RFM69.MOSI 9.07,15.29 v7.54,16.81 7.54,15.8 6.27,15.8 5.77,16.31 5.77,19.86 v7.8,21.89 | v7.8,30.78 7.8,37.13 9.07,37.13 1_RFM69.MOSI
  Bottom 0.254: v7.54,16.81 8.81,18.08 9.07,18.08 2_RFM69.MOSI | v7.8,21.89 7.8,25.2 | 7.8,25.2 v7.8,30.78 | 7.8,25.2 v42.34,25.2
1_D12_MISO  (via drill 0.33)
  Top 0.254: v43.1,16.05 43.1,24.94 43.61,25.45 ATMEGA328P.16 | 10.85,17.07 9.32,17.07 3_RFM69.MISO | v10.85,15.29 10.85,17.07 | 10.85,17.07 11.35,17.58 11.35,26.72 11.1,26.97 11.1,42.47 8.31,42.47 7.8,41.96 7.8,39.42 9.07,39.42 1_RFM69.MISO
  Bottom 0.254: v43.1,16.05 40.82,13.77 37.52,13.77 36.5,12.75 | 36.5,12.75 36.5,9.96 38.02,9.96 ISP.1 | 36.5,12.75 33.96,15.29 v10.85,15.29 10.08,15.29 9.32,16.05 2_RFM69.MISO
1_D13_SCK  (via drill 0.33)
  Top 0.254: 1_RFM69.SCK 9.32,41.45 10.59,40.18 10.59,26.72 10.85,26.47 10.85,20.88 9.32,19.35 3_RFM69.SCK 9.07,19.1 6.53,19.1 v6.53,16.56 | ATMEGA328P.17 45.14,24.18 44.37,23.42 44.37,13.77 45.14,13 45.14,10.21 43.36,8.43 40.56,8.43 40.56,9.7 ISP.3
  Bottom 0.254: ISP.3 40.56,9.7 39.29,8.43 37.26,8.43 31.42,14.27 9.32,14.27 2_RFM69.SCK 9.07,14.27 8.81,14.27 v6.53,16.56
1_RTS  (via drill 0.33)
  Top 0.254: C3.2 60.88,19.35 64.19,19.35 FTDI.6 | v32.94,18.59 32.94,10.97 26.85,4.88 U$6.33
  Bottom 0.254: v32.94,18.59 33.71,19.35 64.19,19.35 FTDI.6
2_ANA  (via drill 0.33)
  Top 1.27: v7.29,9.96 6.78,9.45 6.78,5.38 5.77,4.37 3.99,4.37 2RF.1 3.73,4.37 U$5.P$1
  Bottom 1.27: v7.29,9.96 9.07,9.96 2_RFM69.ANA
3_ANA
  Top 1.27: 3_RFM69.ANA 9.07,23.42 6.78,23.42 6.78,28.24 6.02,29.01 3.99,29.01 3RF.1 3.73,29.26 U$2.P$1
+3V3  (via drill 0.33)
  Top 0.381: 79.89,47.72 C10.1 | IC1.6 79.86,45.89 C11.1 | IC1.2 83.61,46.54 82.94,47.22 82.23,47.22 IC1.8 81.97,47.29 81.2,48.06 79.93,48.06 C10.1 | ATMEGA328P.6 46.86,31.33 47.36,30.83 | ATMEGA328P.4 48.46,31.42 47.86,30.83 47.36,30.83 | 46.06,22.66 ATMEGA328P.18 46.06,24.63 46.06,26.02 47.36,27.33 47.36,30.83 | 46.06,22.66 46.06,21.13 C6.1 | 3V3.2 64.43,45.17 63.17,45.17 | 63.17,45.17 C2.1 C9.1 R1.1 | v34.98,9.19 38.02,12.24 ISP.2 | v6.78,13.51 7.54,12.75 7.54,12.24 v11.35,8.43 | 38.02,12.5 ISP.2 | 38.02,12.5 ISP.2 | v45.39,22.66 45.9,22.66 46.06,22.66 | v39.29,22.66 38.02,21.39 38.02,12.5 | 38.02,12.5 ISP.2 | C11.1 79.93,46.02 79.93,47.55 C10.1 | R9.2 78.16,40.44 78.16,42.47 R10.2 78.16,42.72 78.16,43.99 78.28,44.12 | 78.28,44.12 79.68,45.52 C11.1 | v70.79,44.25 78.16,44.25 78.28,44.12 | v63.17,45.01 63.17,45.17 | v5.77,40.18 5.77,41.96 3.73,43.99 R7.1 | v15.42,34.85 17.7,32.56 17.7,30.28 R2.2 17.96,30.28 22.53,30.28 R5.1 22.78,30.28 25.07,30.28 R6.1 25.32,30.28 27.1,30.28 | 27.1,30.28 27.61,30.28 R4.1 27.86,30.28 28.88,29.26 28.88,25.45 3_RFM69.VDD 28.88,25.2 28.88,24.43 v30.66,22.66 | 27.1,30.28 v27.1,42.72 27.1,45.77 28.63,47.29 1_RFM69.VDD
  Bottom 0.381: v34.98,9.19 29.9,9.19 28.88,8.18 2_RFM69.VDD 28.63,8.18 11.61,8.18 v11.35,8.43 | v6.78,13.51 1.45,18.85 LDR.1 | v45.39,22.66 v39.29,22.66 v30.66,22.66 | v70.79,44.25 70.03,45.01 v63.17,45.01 63.17,42.72 v27.1,42.72 | v5.77,40.18 11.1,34.85 v15.42,34.85
+5V  (via drill 0.33)
  Top 0.381: 5V.2 64.53,39.26 C1.1 61.65,39.17 v61.65,23.16 | v57.33,20.37 56.82,19.86 56.82,15.54 PIEZO.+ 56.82,15.29 56.82,14.78 v58.6,13
  Bottom 0.381: 80.82,9.07 82.98,11.23 IR-TX.4 | 80.82,9.07 80.7,8.94 70.54,8.94 69.01,10.46 FRONT-IR1.1 69.01,10.72 69.01,13 v58.6,13 | IR-TX.4-2 82.98,3.35 82.98,8.94 80.95,8.94 80.82,9.07 | v61.65,23.16 58.85,20.37 v57.33,20.37
BBB_3V3
  Top 0.381: 3V3.3 64.77,47.09 U$6.50 U$6.49
BBB_5V  (via drill 0.33)
  Top 0.381: U$6.51 U$6.52 62.41,50.34 62.92,49.83 62.92,48.31 v63.17,48.06 | v66.73,42.98 64.95,41.2 5V.3
  Bottom 0.381: v66.73,42.98 66.98,43.23 71.3,43.23 71.81,43.74 71.81,48.06 v63.17,48.06
GND  (via drill 0.33)
  Top 0.381: v48.95,29.77 49.26,30.08 ATMEGA328P.3 49.26,34.28 49.2,34.34 | 48.44,25.96 48.46,25.94 ATMEGA328P.21 48.46,22.68 48.44,22.66 | ATMEGA328P.5 47.66,34.07 47.68,34.09 | IC1.7 81.34,46.54 arc-90 v80.96,46.93 | 3RF.G@4 3.73,25.2 | 67.23,3.61 67.25,3.61 67.23,3.61 | 67.49,3.61 67.37,3.61 67.49,3.61 | 66.22,5.13 66.09,5.03 66.22,5.13 | 66.22,4.37 66.06,4.43 66.22,4.37
  Bottom 0.381: 12.37,53.64 12.45,53.66 12.37,53.64 | 68.25,49.83 68.22,49.71 68.25,49.83
  other vias: 47.42,15.29 50.47,20.62 54.53,22.15 54.53,17.32 46.15,30.28 45.84,27.48 45.64,39.42 45.9,46.28 58.34,40.69 60.88,49.07 80.95,44.75 38.53,36.88 7.8,2.08 4.24,10.21 3.99,19.1 2.46,23.93 5.3,13.42 16.69,17.32 22.78,16.56 18.21,12.5 14.91,9.45 30.91,11.48 29.13,16.56 30.4,18.85 16.94,23.93 37.52,30.28 31.67,30.28 54.53,38.4 58.6,17.32 77.65,11.73 71.81,11.48 47.17,8.18 13.39,18.59 18.21,37.13 15.16,44.75 32.69,46.02 67.49,39.67 2.97,35.61 5.26,45.52 7.04,53.39 61.08,20.93 60.83,14.58 34.98,12.5 52.41,39.03 59.66,28.13 80.95,1.57
  pour Bottom: -2.87,58.98 94.41,58.98 94.41,-7.82 -2.87,-7.82
  pour Top: -1.09,58.22 92.13,58.22 92.13,-5.54 -1.35,-5.54 -1.35,58.22
N$1
  Top 0.381: ATMEGA328P.7 46.06,33.52 46.36,33.83 46.36,35.65 C7.1 46.45,37.81 Q1.1
N$2
  Top 0.254: R3.1 53.26,8.69 PIEZO.DUMMY 63.68,8.69 PIEZO.DUMMY1 63.93,8.69 63.93,15.29 PIEZO.-
N$3  (via drill 0.33)
  Top 0.254: v75.62,7.67 75.62,6.65 R100.1
  Bottom 0.254: v75.62,7.67 75.36,7.42 73.84,7.42 IR-TX.1 73.58,7.42 69.77,7.42 69.01,8.18 FRONT-IR.1
N$4
  Top 0.254: R100.2 77.39,6.65 76.63,7.42 76.63,9.7 76.89,9.96 82.22,9.96 82.22,8.18 BC817-40_2.C
N$5
  Top 0.254: D1.3 52.76,46.02 53.77,47.04 53.77,47.55 56.57,50.34 57.07,50.34 U$6.56
N$6
  Top 0.381: MCP1703.2 66.58,44.02 3V3.1
N$7
  Top 0.381: ATMEGA328P.8 45.26,33.43 44.36,34.33 44.36,35.71 C8.1 44.34,38.57 Q1.2
N$8
  Top 0.254: R3.2 51.49,8.69 51.99,9.19 51.99,10.72 BC817-40.C
N$9  (via drill 0.33)
  Top 0.254: v20.75,6.91 11.86,15.8 v11.86,30.28
  Bottom 0.254: 64.44,8.43 67.49,8.43 FRONT-IR.2 | 64.44,8.43 LED.2 64.44,8.43 | 64.44,8.43 62.92,6.91 v20.75,6.91 | v11.86,30.28 3.48,38.66 2.97,38.66 IR/LED.1
N$10  (via drill 0.33)
  Top 0.254: R7.2 1.96,43.99 2.72,43.23 2.72,41.45 IR/LED.2 | v46.66,10.97 43.61,7.92 33.71,7.92 33.71,31.55 v30.4,34.85
  Bottom 0.254: v46.66,10.97 67.23,10.97 67.49,10.72 FRONT-IR1.2 | v30.4,34.85 24.05,41.2 2.97,41.2 IR/LED.2
N$15
  Top 0.254: R103.2 53.26,15.54 53.26,13 BC817-40.B
N$16  (via drill 0.33)
  Top 0.254: R2.1 17.7,28.5 15.42,28.5 C100.2 15.16,28.24 v15.16,13.51
  Bottom 0.254: v15.16,13.51 14.15,12.5 4.5,12.5 1.45,15.54 IR-RX.VCC
N$19
  Top 0.254: R101.2 77.65,8.94 79.93,8.94 BC817-40_2.B
SYS_RESET  (via drill 0.33)
  Top 0.254: 55.69,45.89 55.8,45.77 v55.8,29.51 55.8,28.75 58.34,26.21 58.34,19.86 58.85,19.35 C3.1 59.11,19.35 59.61,18.85 59.61,10.46 v58.85,9.7 | v53.52,29.01 52.5,29.01 ATMEGA328P.29
  Top 0.381: R1.2 56.67,46.87 55.69,45.89 D1.1
  Bottom 0.254: v53.52,29.01 54.03,29.51 v55.8,29.51 | v58.85,9.7 43.1,9.7 ISP.5
VIN  (via drill 0.33)
  Top 0.381: C4.1 72.57,45.52 70.03,45.52 70.03,46.02 MCP1703.3 69.77,46.02 69.77,38.15 64.95,38.15 5V.1 64.69,37.9 v63.42,36.63 | v59.61,35.36 v59.61,31.55
  Bottom 0.381: v59.61,31.55 64.19,26.97 FTDI.3 | v59.61,35.36 60.88,36.63 v63.42,36.63

### Text on the board
tNames: GND | GND | RX | TX | 5V | 3V3 | GND | Version 1.1 | GND | GND | SYS-Reset | GND | GND | VCC | TXD | RXD | DTR | IR-RX | RTS | GND | GND